# Altium schematic sheet DfPlayer_board.SchDoc
size A4; SheetNumber: 1; SheetTotal: 1
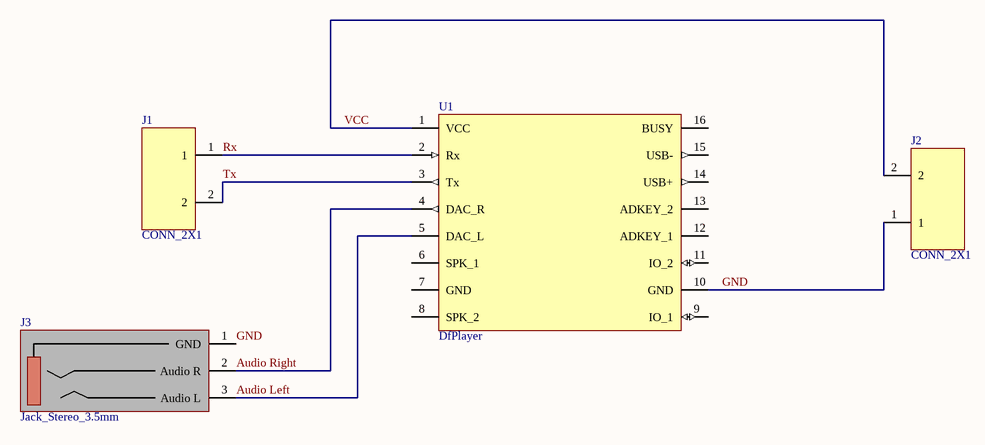
[diagram p0: DfPlayer_board.SchDoc]

## Parts
J1  CONN_2X1
J2  CONN_2X1
J3  Jack_Stereo_3.5mm
U1  DfPlayer

## Nets
Audio Left: J3.3(Audio_L) U1.5(DAC_L)
Audio Right: J3.2(Audio_R) U1.4(DAC_R)
GND: J2.1 J3.1(GND) U1.10(GND)
Rx: J1.1 U1.2(Rx)
Tx: J1.2 U1.3(Tx)
VCC: J2.2 U1.1(VCC)

Not connected (* = marked no-connect by the designer): U1 6(SPK_1) 7(GND) 8(SPK_2) 9(IO_1) 11(IO_2) 12(ADKEY_1) 13(ADKEY_2) 14(USB+) 15(USB-) 16(BUSY)

## Library data of the parts
J1 J2 = CONN_2X1: Connector 2 vias 1 Row
J3 = Jack_Stereo_3.5mm: Conector Jack stereo 3.5mm sin microfono
U1 = DfPlayer: Header for DfPlayer mini MP3 2x8 pins